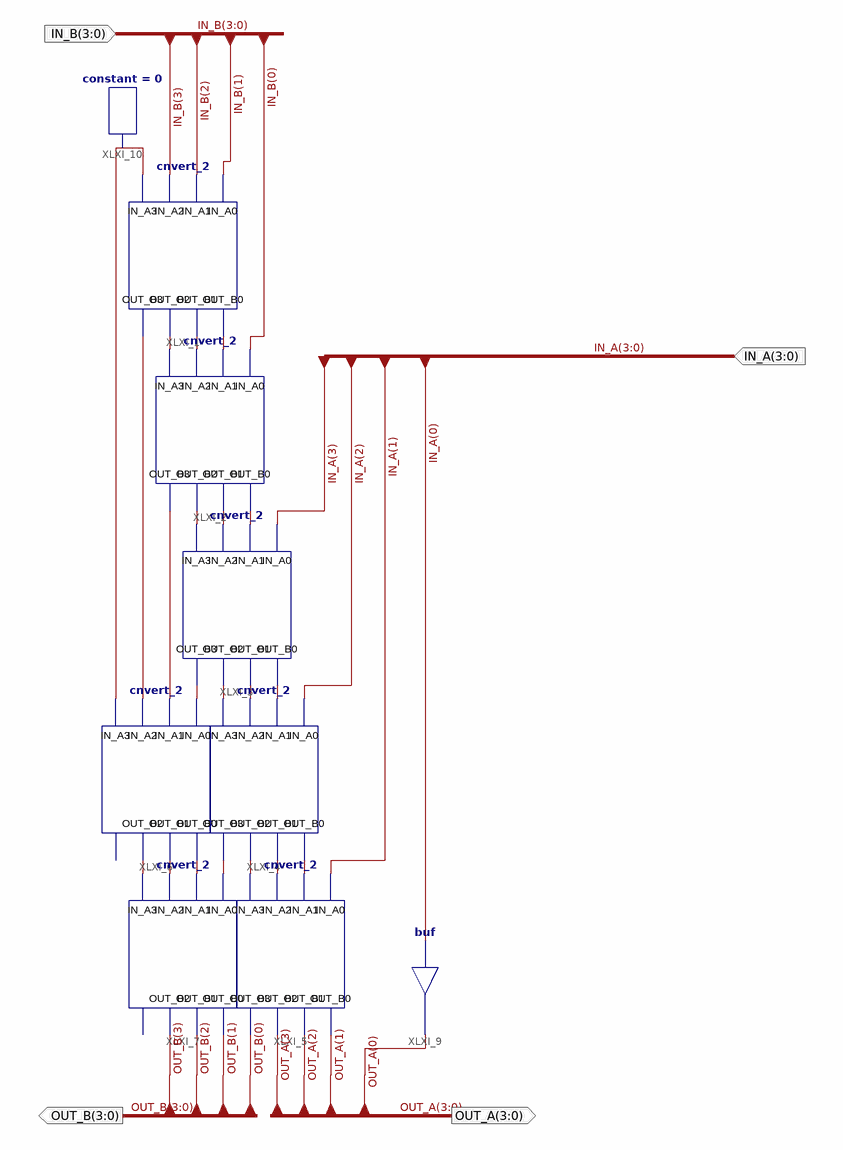
[diagram p0: schematic sheet 1]
// Xilinx ISE schematic CNVERT_3.sch (spartan3e) as structural Verilog: 9 symbols, 4 ports
module CNVERT_3 (
  input  [3:0] IN_A,
  input  [3:0] IN_B,
  output [3:0] OUT_A,
  output [3:0] OUT_B
);

  wire XLXN_1, XLXN_2, XLXN_3, XLXN_4, XLXN_5, XLXN_6, XLXN_7, XLXN_8, XLXN_9, XLXN_10, XLXN_11, XLXN_12,
       XLXN_13, XLXN_14, XLXN_15, XLXN_16, XLXN_17, XLXN_18, XLXN_19, XLXN_20;

  cnvert_2 XLXI_1 (
    .IN_A0(IN_B[1]), .IN_A1(IN_B[2]), .IN_A2(IN_B[3]), .IN_A3(XLXN_20), .OUT_B0(XLXN_1), .OUT_B1(XLXN_2),
    .OUT_B2(XLXN_3), .OUT_B3(XLXN_19));
  cnvert_2 XLXI_2 (
    .IN_A0(IN_B[0]), .IN_A1(XLXN_1), .IN_A2(XLXN_2), .IN_A3(XLXN_3), .OUT_B0(XLXN_4), .OUT_B1(XLXN_5),
    .OUT_B2(XLXN_6), .OUT_B3(XLXN_18));
  cnvert_2 XLXI_3 (
    .IN_A0(IN_A[3]), .IN_A1(XLXN_4), .IN_A2(XLXN_5), .IN_A3(XLXN_6), .OUT_B0(XLXN_7), .OUT_B1(XLXN_8),
    .OUT_B2(XLXN_9), .OUT_B3(XLXN_13));
  cnvert_2 XLXI_4 (
    .IN_A0(IN_A[2]), .IN_A1(XLXN_7), .IN_A2(XLXN_8), .IN_A3(XLXN_9), .OUT_B0(XLXN_10), .OUT_B1(XLXN_11),
    .OUT_B2(XLXN_12), .OUT_B3(XLXN_14));
  cnvert_2 XLXI_5 (
    .IN_A0(IN_A[1]), .IN_A1(XLXN_10), .IN_A2(XLXN_11), .IN_A3(XLXN_12), .OUT_B0(OUT_A[1]), .OUT_B1(OUT_A[2]),
    .OUT_B2(OUT_A[3]), .OUT_B3(OUT_B[0]));
  cnvert_2 XLXI_6 (
    .IN_A0(XLXN_13), .IN_A1(XLXN_18), .IN_A2(XLXN_19), .IN_A3(XLXN_20), .OUT_B0(XLXN_15), .OUT_B1(XLXN_16),
    .OUT_B2(XLXN_17));  // open: OUT_B3
  cnvert_2 XLXI_7 (
    .IN_A0(XLXN_14), .IN_A1(XLXN_15), .IN_A2(XLXN_16), .IN_A3(XLXN_17), .OUT_B0(OUT_B[1]), .OUT_B1(OUT_B[2]),
    .OUT_B2(OUT_B[3]));  // open: OUT_B3
  buf XLXI_9 (OUT_A[0], IN_A[0]);
  constant #(.CValue("0")) XLXI_10 (.O(XLXN_20));
endmodule
